# EasyEDA schematic SCH_Yunis_PCB_2026-04-03.json
TITLE: Yunis_PCB; REV: 1.0; Date: 2026-03-24; Sheet: 1/1; Drawn By: qwertyuiop2007.bhu; Company: Your Company
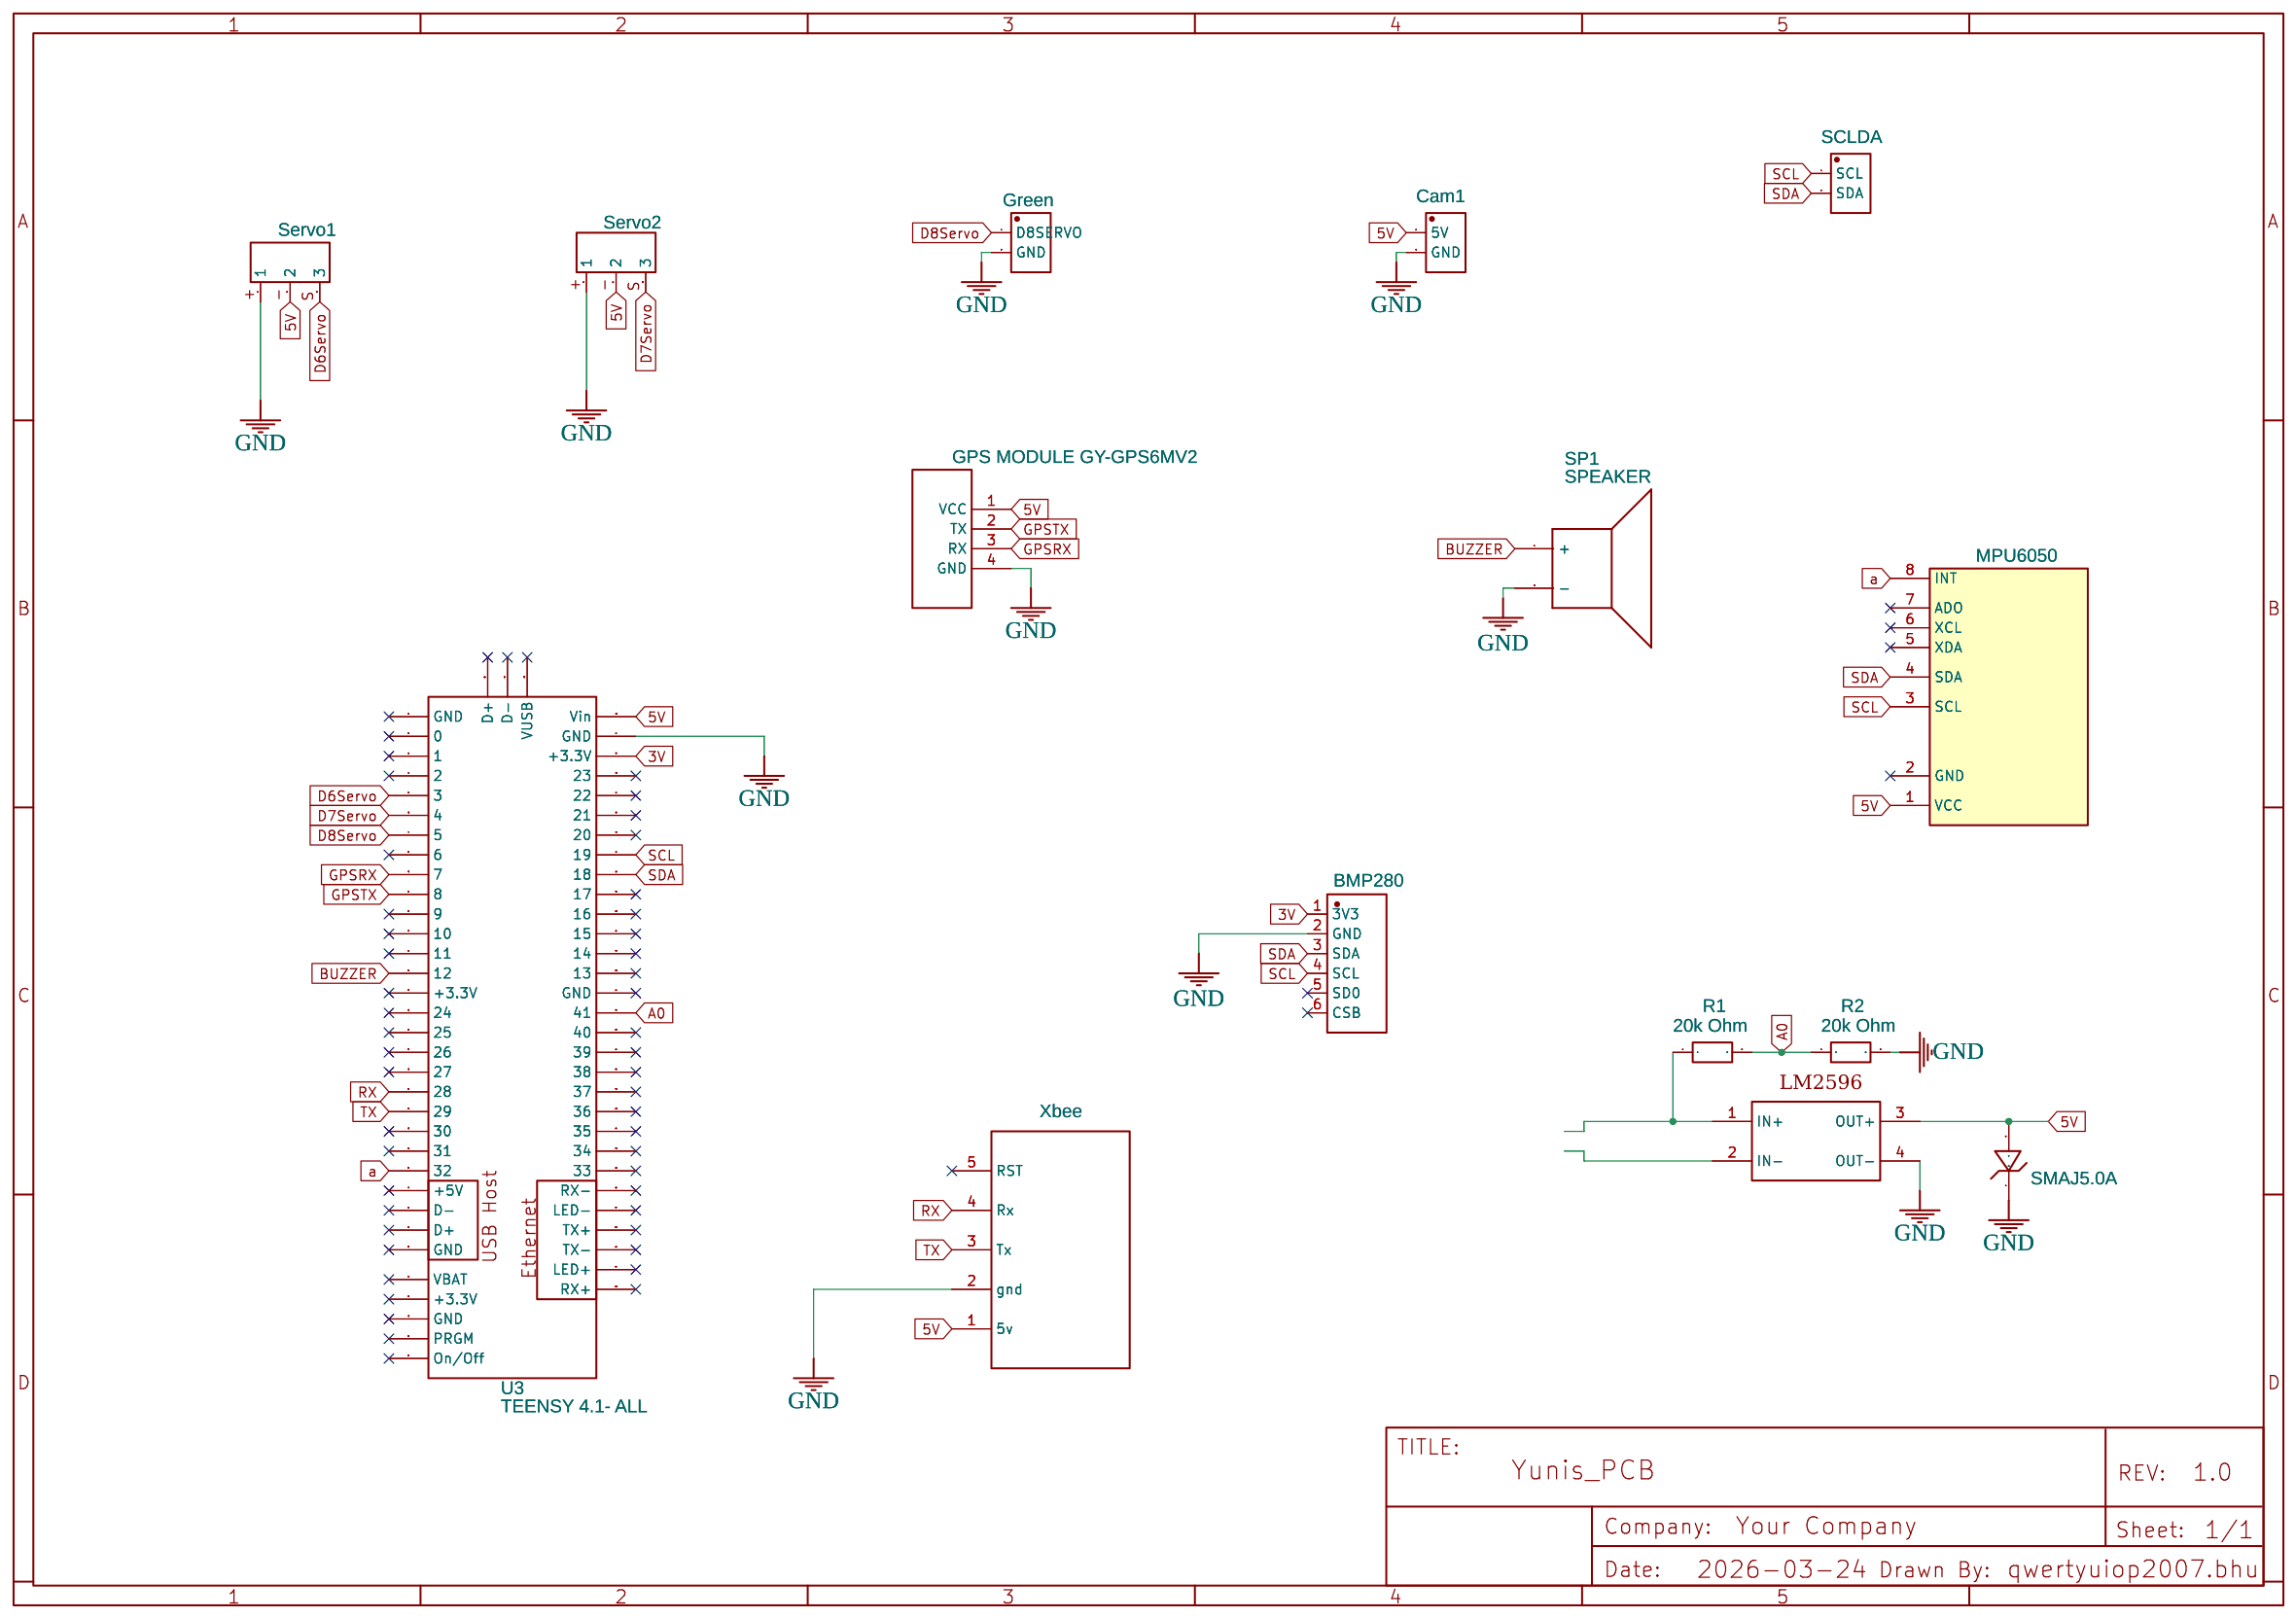
[diagram p0: schematic sheet]

## Parts
BUZZER1  SCLDA  [PINHEADER1X2]
BUZZER2  Cam1  [PINHEADER1X2]
BUZZER3  Green  [PINHEADER1X2]
P1  Servo2  [CONNECTOR_PINHEADER_2.54MM:PINHEADER_1X3]
P2  Servo1  [CONNECTOR_PINHEADER_2.54MM:PINHEADER_1X3]
P3  MPU6050  [MPU6050]
R1  20k Ohm  [R0603]
R2  20k Ohm  [R0603]
SP1  SPEAKER  [SPEAKER]
U1  GPS MODULE GY-GPS6MV2  [GPS MODULE GY-GPS6MV2]
U2  BMP280  [COMM-TH_BMP280-TH]
U3  TEENSY 4.1- ALL  [TEENSY-4.1-ALL-PINS_CORRECTED]
U4  BuckConverters_LM2596_Adj  [LM2596:YAAJ_DCDC_STEPDOWN_LM2596]
U5  Xbee  [XBEE MODULO]
U6  SMAJ5.0A  [SMAJ5.0A]

## Library data of the parts
BUZZER1-BUZZER3 = PINHEADER1x2: Supplier Part: undefined; Contributor: Elvis Channel
P1 P2 = HEADER PAD 3 PIN: Supplier: LCSC; Manufacturer: BOOMELE; Manufacturer Part: Female headerHDR1X8-2.54; Supplier Part: C27438; JLCPCB Part Class: Extended Part; Contributor: ortega.angel.2505
P3 = MPU6050: sourceId: 1T5FDZYC8; Contributor: wlsdud6585
R1 R2 = R_0603_EU: Contributor: LCEDA_Lib
SP1 = SPEAKER: Contributor: kruemelmonsterxD
U1 = GPS MODULE GY-GPS6MV2: Contributor: mitchmim
U2 = BMP280_C9900132626: Supplier: LCSC; Supplier Part: C9900132626; Manufacturer: null; Contributor: lcsc
U3 = TEENSY 4.1- ALL: Contributor: stretchlinesl
U4 = BuckConverters_LM2596_Adj: Servo 5V; Add into BOM: yes; Convert to PCB: yes; Origin Footprint: YAAJ_DCDC_StepDown_LM2596; Contributor: ee22b001
U5 = Xbee Modulo: Contributor: antoniovmonreal
U6 = SMAJ5.0A: Manufacturer Part: Littlefuse; Supplier: Mouser; Supplier Part: 576-SMAJ5.0A; link: https://www.mouser.es/ProductDetail/576-SMAJ5.0A; Contributor: josito.r2

## Nets
3V: U2.1(3V3) U3.46(+3.3V)
5V: BUZZER2.1(5V) P1.2 P2.2 P3.1(VCC) U1.1(VCC) U3.48(Vin) U4.3(OUT+) U5.1(5v) U6.2(A)
GND: BUZZER2.2(GND) BUZZER3.2(GND) P1.1 P2.1 R2.2 SP1.2(-) U1.4(GND) U2.2(GND) U3.47(GND) U4.4(OUT-) U5.2(gnd) U6.1(C)
a: P3.8(INT) U3.24(32)
A0: R1.2 R2.1 U3.33(41)
BUZZER: SP1.1(+) U3.14(12)
D6Servo: P2.3 U3.5(3)
D7Servo: P1.3 U3.6(4)
D8Servo: BUZZER3.1(D8SERVO) U3.7(5)
GPSRX: U1.3(RX) U3.9(7)
GPSTX: U1.2(TX) U3.10(8)
RX: U3.20(28) U5.4(Rx)
SCL: BUZZER1.1(SCL) P3.3(SCL) U2.4(SCL) U3.41(19)
SDA: BUZZER1.2(SDA) P3.4(SDA) U2.3(SDA) U3.40(18)
TX: U3.21(29) U5.3(Tx)
Net-(R1-1): R1.1 U4.1(IN+)

Not connected (* = marked no-connect by the designer): P3 2(GND)* 5(XDA)* 6(XCL)* 7(ADO)*; U2 5(SD0)* 6(CSB)*; U3 1(GND)* 2(0)* 3(1)* 4(2)* 8(6)* 11(9)* 12(10)* 13(11)* 15(+3.3V)* 16(24)* 17(25)* 18(26)* 19(27)* 22(30)* 23(31)* 25(33)* 26(34)* 27(35)* 28(36)* 29(37)* 30(38)* 31(39)* 32(40)* 34(GND)* 35(13)* 36(14)* 37(15)* 38(16)* 39(17)* 42(20)* 43(21)* 44(22)* 45(23)* 49(GND)* 50(PRGM)* 51(On/Off)* 52(VUSB)* 60(RX+)* 61(LED+)* 62(TX-)* 63(TX+)* 64(LED-)* 65(RX-)* 66(D+)* 67(D-)* 68(GND)* 69(D+)* 70(D-)* 71(+5V)* 72(VBAT)* 73(+3.3V)*; U4 2(IN-); U5 5(RST)*
